# Altium project ALight.PrjPcb
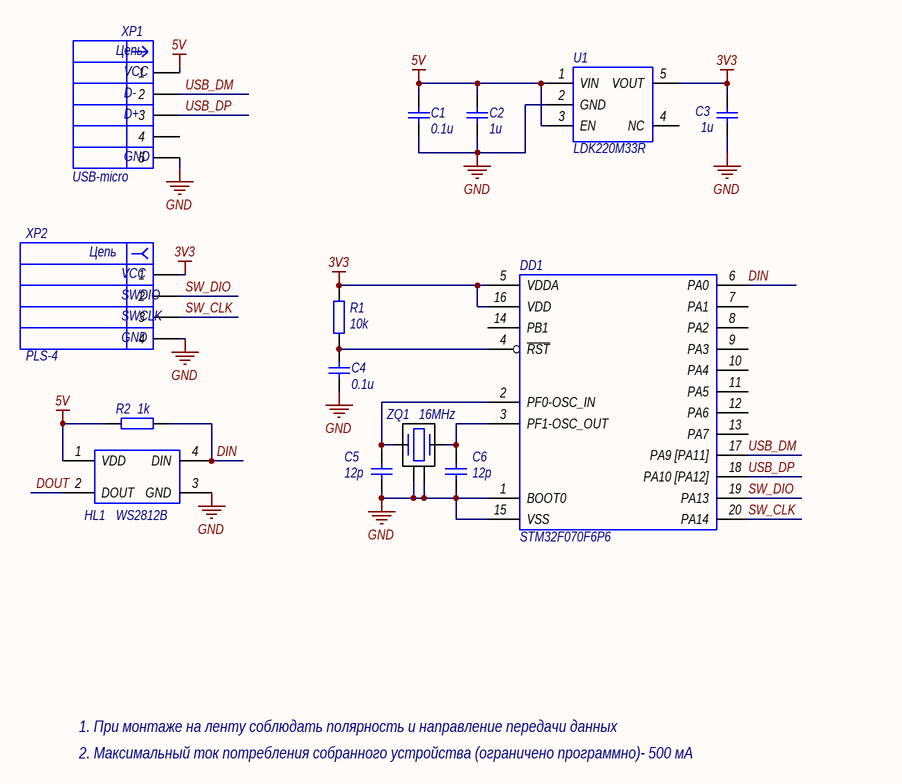
[diagram p0: ALight.SchDoc]
1 sheet, 14 parts. Net scope: global (net labels, ports and power ports of the same name join across sheets).
Board file: ALight.PcbDoc

## Sheet ALight.SchDoc
size 209 x 297 mm; 1_Listov: 1; 1_Naimenovanie1: Контроллер подсветки; 1_Naimenovanie2: окружения ALight-1v2; 1_Naimenovanie3: схема электрическая принципиальная; 1_Oboznachenie: ДКТМ.468354.001 Э3; 1_T1Razrabotal: Карманов Д.; 1_PervPrimen: ДКТМ.468354.001; PageSetup: Record=PageOptions|CenterHorizontal=True|CenterVertical=True|PrintScale=0.99|XCorrection=1.00|YCorrection=1.00|PrintKind=2|BorderSize=5000000|LeftOffset=0|BottomOffset=0|Orientation=1|PaperLength=1000|PaperWidth=1000|Scale=100|PaperSource=7|PrintQuality=-3|MediaType=1|DitherType=10|PrintScaleMode=1|PaperKind=A4|PaperIndex=9

### Parts
C1  0.1u  [CAPACITOR 0603]
C2  1u  [CAPACITOR 0603]
C3  1u  [CAPACITOR 0603]
C4  0.1u  [CAPACITOR 0603]
C5  12p  [CAPACITOR 0603]
C6  12p  [CAPACITOR 0603]
DD1  STM32F070F6P6  [TSOP-20]
HL1  WS2812B  [LED WS2812]
R1  10k  [RESISTOR 0603]
R2  1k  [RESISTOR 0603]
U1  LDK220M33R  [SOT23-5]
XP1  USB-micro  [USB-micro]
XP2  PLS-4  [SWD]
ZQ1  16MHz  [SMD0302C4]

### Nets
3V3: C3.1 DD1.5(VDDA) DD1.16(VDD) R1.1 U1.5(VOUT) XP2.1
5V: C1.1 C2.1 HL1.1(VDD) R2.1 U1.1(VIN) U1.3(EN) XP1.1
GND: C1.2 C2.2 C3.2 C4.2 C5.1 C6.1 DD1.1(BOOT0) DD1.15(VSS) HL1.3(GND) U1.2(GND) XP1.5 XP2.4 ZQ1.2 ZQ1.4
DIN: DD1.6(PA0) HL1.4(DIN) R2.2
DOUT: HL1.2(DOUT)
SW_CLK: DD1.20(PA14) XP2.3
SW_DIO: DD1.19(PA13) XP2.2
USB_DM: DD1.17(PA9_[PA11]) XP1.2
USB_DP: DD1.18(PA10_[PA12]) XP1.3
NetC4_1: C4.1 DD1.4(~{RST}) R1.2
NetC5_2: C5.2 DD1.2(PF0-OSC_IN) ZQ1.1
NetC6_2: C6.2 DD1.3(PF1-OSC_OUT) ZQ1.3

Not connected (* = marked no-connect by the designer): DD1 7(PA1) 8(PA2) 9(PA3) 10(PA4) 11(PA5) 12(PA6) 13(PA7) 14(PB1); U1 4(NC); XP1 4

### Notes on the sheet
- (near XP1) Цепь
- Цепь
- (near XP2) VCC
- (near XP2) SWDIO
- (near XP2) SWCLK
- (near XP2) GND
- 1. При монтаже на ленту соблюдать полярность и направление передачи данных
- 2. Максимальный ток потребления собранного устройства (ограничено программно)- 500 мА
- Перв. примен.
- Справ. №
- Подп. и дата
- Инв. № дубл.
- Взам. инв. №
- Изм
- Лист
- № докум.
- Подпись
- Дата
- Лит.
- Масса
- Масштаб
- Разраб.
- Пров.
- Т. контр.
- Листов
- Инв. № подл.
- Н. контр.
- Утв
- Копировал:
- Формат А4
- (in symbol USB-M) VCC; D-; D+; GND

### Library data of the parts
C1-C6 = SMD-CAP: Capacitor
DD1 = STM32F070F6P6: Controller
HL1 = WS2812B: LED
R1 R2 = SMD-RES: Resistor
U1 = TPS76333DBVR: POWER
XP1 = USB-M: Connector
XP2 = XP4: Connector
ZQ1 = Quartz